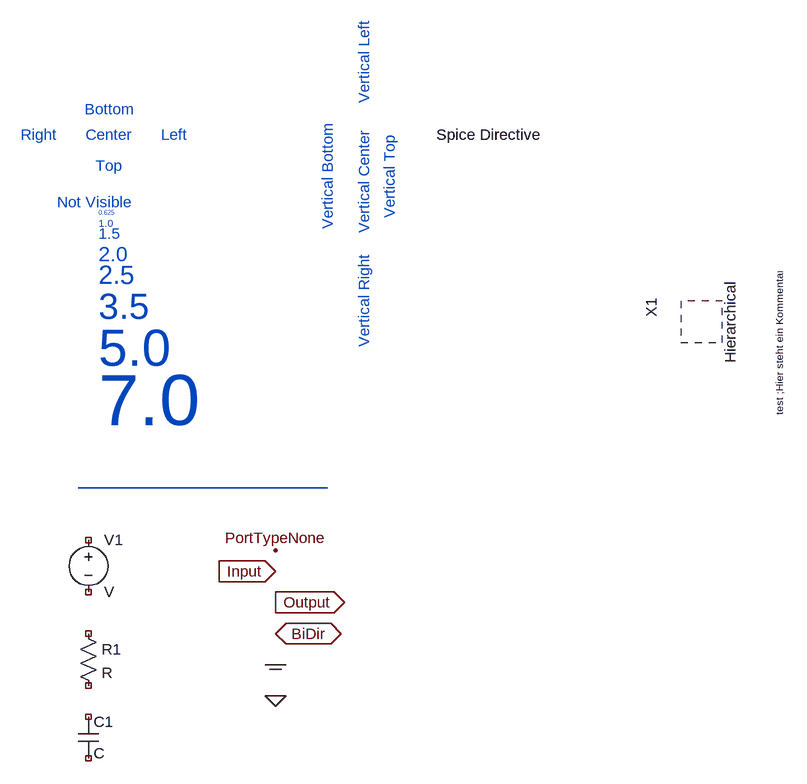
[diagram p0: schematic text_sample copy.asc]
text_sample copy.asc, the LTspice schematic file:
Version 4.1
SHEET 1 1728 1704
WIRE 416 1200 32 1200
FLAG 336 1520 0
FLAG 336 1296 PortTypeNone
FLAG 336 1328 Input
IOPIN 336 1328 In
FLAG 336 1376 Output
IOPIN 336 1376 Out
FLAG 336 1424 BiDir
IOPIN 336 1424 BiDir
FLAG 336 1472 COM
SYMBOL Hierarchical 992 944 M90
WINDOW 0 -22 -62 Bottom 2
WINDOW 39 -74 120 Left 1
SYMATTR InstName X1
SYMATTR SpiceLine test ;Hier steht ein Kommentar
SYMBOL voltage 48 1264 R0
SYMATTR InstName V1
SYMBOL res 32 1408 R0
SYMATTR InstName R1
SYMBOL cap 32 1552 R0
SYMATTR InstName C1
TEXT 160 656 Left 2 ;Left
TEXT 0 656 Right 2 ;Right
TEXT 80 656 Center 2 ;Center
TEXT 80 688 Top 2 ;Top
TEXT 80 632 Bottom 2 ;Bottom
TEXT 0 760 Left 2 ;Not Visible
TEXT 64 776 Left 0 ;0.625
TEXT 64 792 Left 1 ;1.0
TEXT 64 808 Left 2 ;1.5
TEXT 64 840 Left 3 ;2.0
TEXT 64 872 Left 4 ;2.5
TEXT 64 920 Left 5 ;3.5
TEXT 64 984 Left 6 ;5.0
TEXT 64 1064 Left 7 ;7.0
TEXT 584 656 Left 2 !Spice Directive
TEXT 472 608 VLeft 2 ;Vertical Left
TEXT 472 840 VRight 2 ;Vertical Right
TEXT 472 728 VCenter 2 ;Vertical Center
TEXT 496 720 VTop 2 ;Vertical Top
TEXT 432 720 VBottom 2 ;Vertical Bottom

The netlist it stands for:
* text_sample copy.asc
* X1: Hierarchical test ;Hier steht ein Kommentar (symbol Hierarchical not available, pin order unknown); nets seen at it: 
V1 NC_01 NC_02 V
R1 NC_03 NC_04 R
C1 NC_05 NC_06 C
* Left
* Right
* Center
* Top
* Bottom
* Not Visible
* 0.625
* 1.0
* 1.5
* 2.0
* 2.5
* 3.5
* 5.0
* 7.0
Spice Directive
* Vertical Left
* Vertical Right
* Vertical Center
* Vertical Top
* Vertical Bottom
.backanno
.end